# Altium schematic sheet KeyInput_ABH.SchDoc
size A4
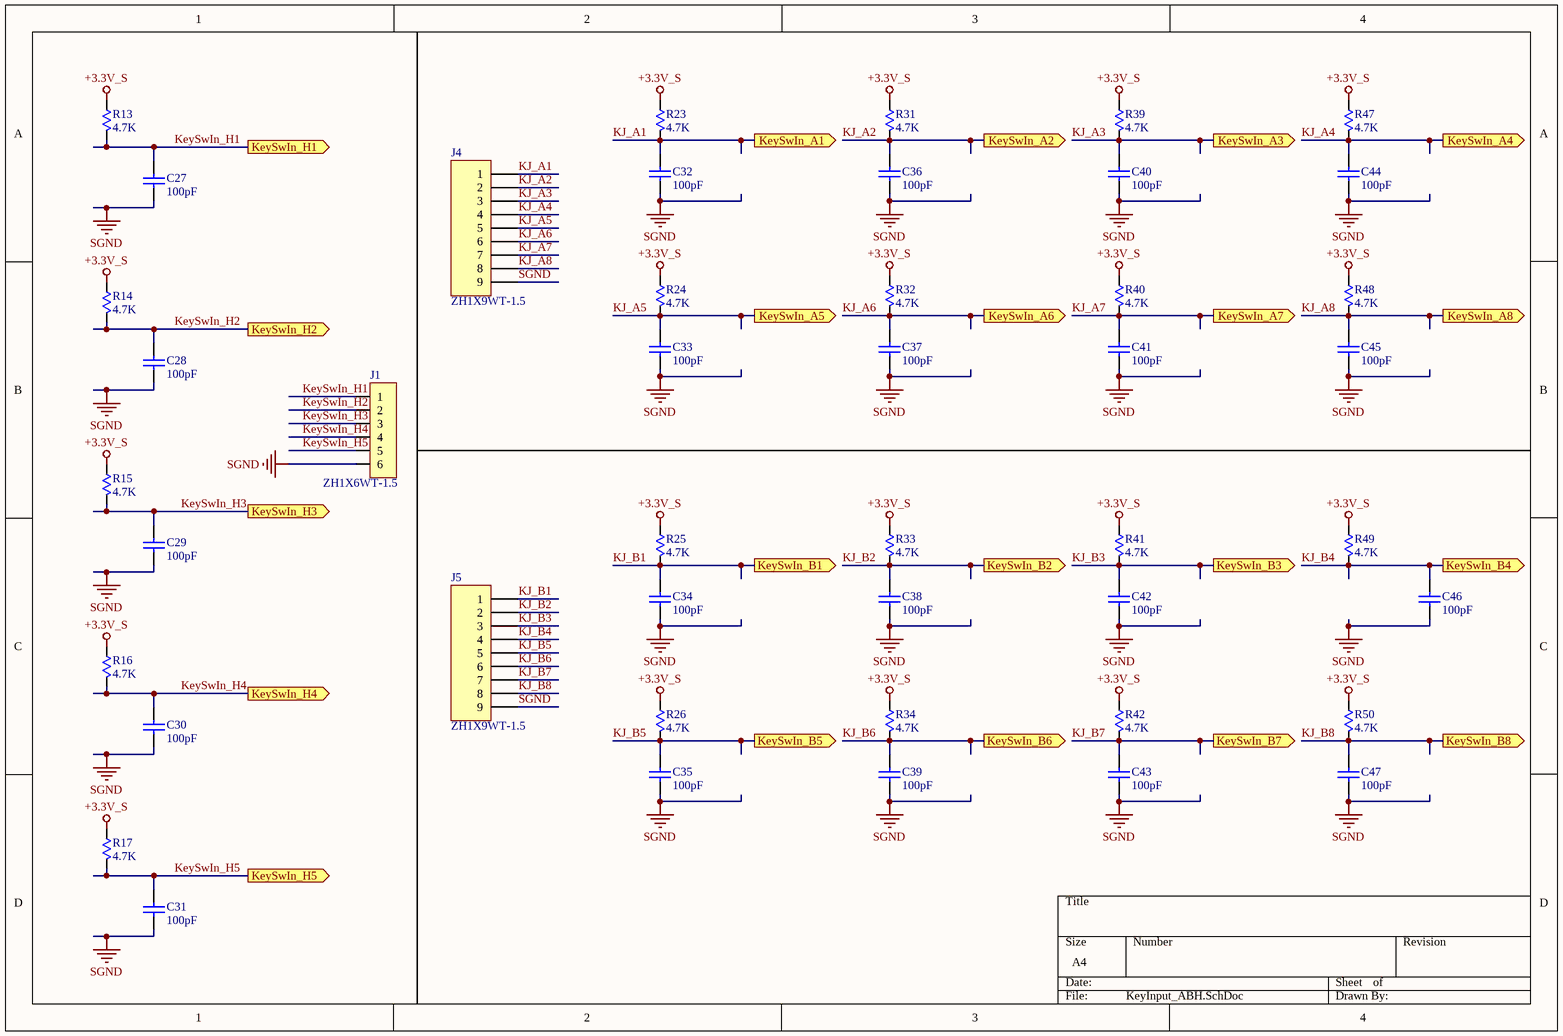
[diagram p0: KeyInput_ABH.SchDoc]

## Parts
C27  100pF  [C0805]
C28  100pF  [C0805]
C29  100pF  [C0805]
C30  100pF  [C0805]
C31  100pF  [C0805]
C32  100pF  [C0805]
C33  100pF  [C0805]
C34  100pF  [C0805]
C35  100pF  [C0805]
C36  100pF  [C0805]
C37  100pF  [C0805]
C38  100pF  [C0805]
C39  100pF  [C0805]
C40  100pF  [C0805]
C41  100pF  [C0805]
C42  100pF  [C0805]
C43  100pF  [C0805]
C44  100pF  [C0805]
C45  100pF  [C0805]
C46  100pF  [C0805]
C47  100pF  [C0805]
J1  ZH1X6WT-1.5  [ZH1X6WT-1.5]
J4  ZH1X9WT-1.5  [ZH1X9WT-1.5]
J5  ZH1X9WT-1.5  [ZH1X9WT-1.5]
R13  4.7K  [R0805]
R14  4.7K  [R0805]
R15  4.7K  [R0805]
R16  4.7K  [R0805]
R17  4.7K  [R0805]
R23  4.7K  [R0805]
R24  4.7K  [R0805]
R25  4.7K  [R0805]
R26  4.7K  [R0805]
R31  4.7K  [R0805]
R32  4.7K  [R0805]
R33  4.7K  [R0805]
R34  4.7K  [R0805]
R39  4.7K  [R0805]
R40  4.7K  [R0805]
R41  4.7K  [R0805]
R42  4.7K  [R0805]
R47  4.7K  [R0805]
R48  4.7K  [R0805]
R49  4.7K  [R0805]
R50  4.7K  [R0805]

## Ports
KeySwIn_A1 (out), KeySwIn_A2 (out), KeySwIn_A3 (out), KeySwIn_A4 (out), KeySwIn_A5 (out), KeySwIn_A6 (out), KeySwIn_A7 (out), KeySwIn_A8 (out), KeySwIn_B1 (out), KeySwIn_B2 (out), KeySwIn_B3 (out), KeySwIn_B4 (out), KeySwIn_B5 (out), KeySwIn_B6 (out), KeySwIn_B7 (out), KeySwIn_B8 (out), KeySwIn_H1 (out), KeySwIn_H2 (out), KeySwIn_H3 (out), KeySwIn_H4 (out), KeySwIn_H5 (out)

## Nets
+3.3V_S: R13.2 R14.2 R15.2 R16.2 R17.2 R23.2 R24.2 R25.2 R26.2 R31.2 R32.2 R33.2 R34.2 R39.2 R40.2 R41.2 R42.2 R47.2 R48.2 R49.2 R50.2
SGND: C27.2 C28.2 C29.2 C30.2 C31.2 C32.2 C33.2 C34.2 C35.2 C36.2 C37.2 C38.2 C39.2 C40.2 C41.2 C42.2 C43.2 C44.2 C45.2 C46.2 C47.2 J1.6 J4.9 J5.9
KeySwIn_H1: C27.1 J1.1 R13.1 ; port KeySwIn_H1
KeySwIn_H2: C28.1 J1.2 R14.1 ; port KeySwIn_H2
KeySwIn_H3: C29.1 J1.3 R15.1 ; port KeySwIn_H3
KeySwIn_H4: C30.1 J1.4 R16.1 ; port KeySwIn_H4
KeySwIn_H5: C31.1 J1.5 R17.1 ; port KeySwIn_H5
KJ_A1: C32.1 J4.1 R23.1 ; port KeySwIn_A1
KJ_A2: C36.1 J4.2 R31.1 ; port KeySwIn_A2
KJ_A3: C40.1 J4.3 R39.1 ; port KeySwIn_A3
KJ_A4: C44.1 J4.4 R47.1 ; port KeySwIn_A4
KJ_A5: C33.1 J4.5 R24.1 ; port KeySwIn_A5
KJ_A6: C37.1 J4.6 R32.1 ; port KeySwIn_A6
KJ_A7: C41.1 J4.7 R40.1 ; port KeySwIn_A7
KJ_A8: C45.1 J4.8 R48.1 ; port KeySwIn_A8
KJ_B1: C34.1 J5.1 R25.1 ; port KeySwIn_B1
KJ_B2: C38.1 J5.2 R33.1 ; port KeySwIn_B2
KJ_B3: C42.1 J5.3 R41.1 ; port KeySwIn_B3
KJ_B4: C46.1 J5.4 R49.1 ; port KeySwIn_B4
KJ_B5: C35.1 J5.5 R26.1 ; port KeySwIn_B5
KJ_B6: C39.1 J5.6 R34.1 ; port KeySwIn_B6
KJ_B7: C43.1 J5.7 R42.1 ; port KeySwIn_B7
KJ_B8: C47.1 J5.8 R50.1 ; port KeySwIn_B8

## Library data of the parts
C27-C47 = Cap: Capacitor; Value: 22pF; Published: 8-Jun-2000; Revision: July-2002: Re-released for DXP Platform.; Publisher: Altium Limited
J1 = HEADER1X6
J4 J5 = Header 9: Header, 9-Pin; LatestRevisionDate: 17-Jul-2002; LatestRevisionNote: Re-released for DXP Platform.; Publisher: Altium Limited
R13-R17 R23-R26 R31-R34 R39-R42 R47-R50 = RES: Resistor; Published: 8-Jun-2000; LatestRevisionDate: 17-Jul-2002; LatestRevisionNote: Re-released for DXP Platform.; PackageReference: AXIAL-0.3; Publisher: Altium Limited; Value: 4.7K